# EAGLE board protoCtrl (EAGLE 6.3)
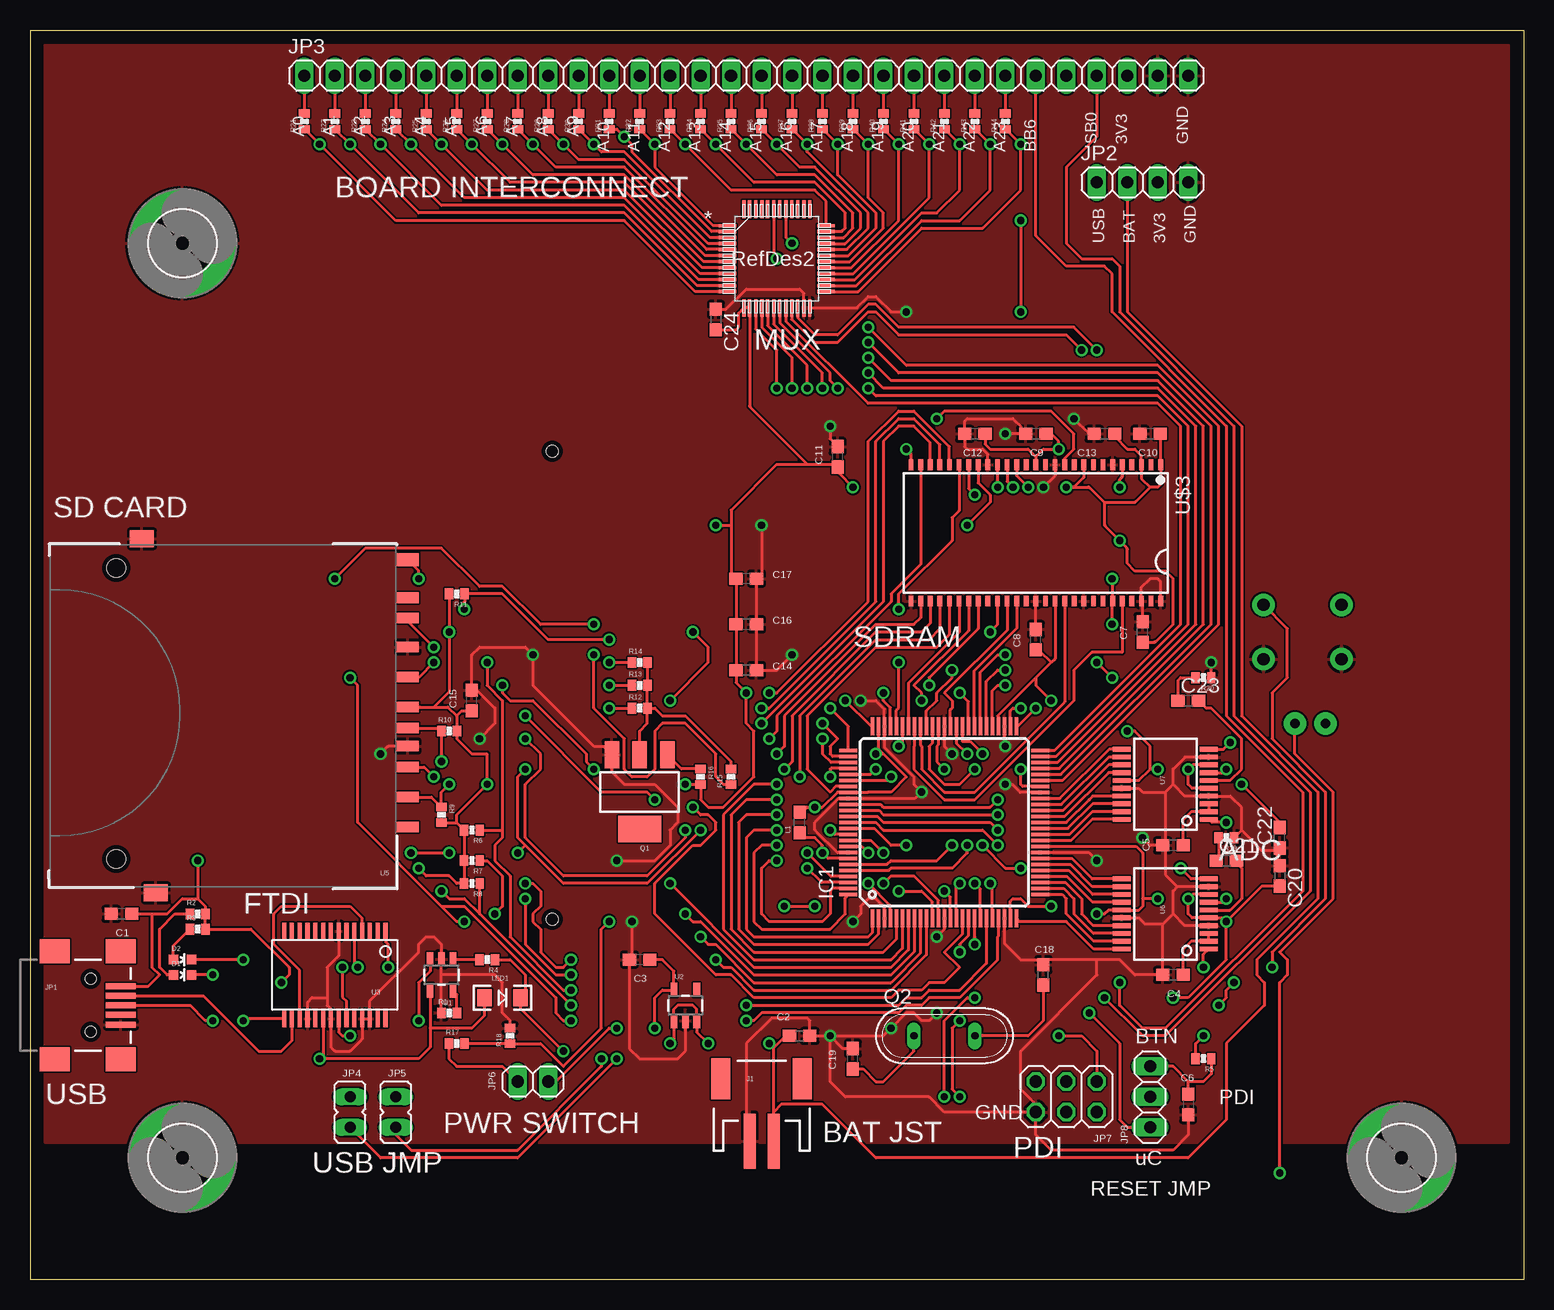
[diagram p2: board, top side]
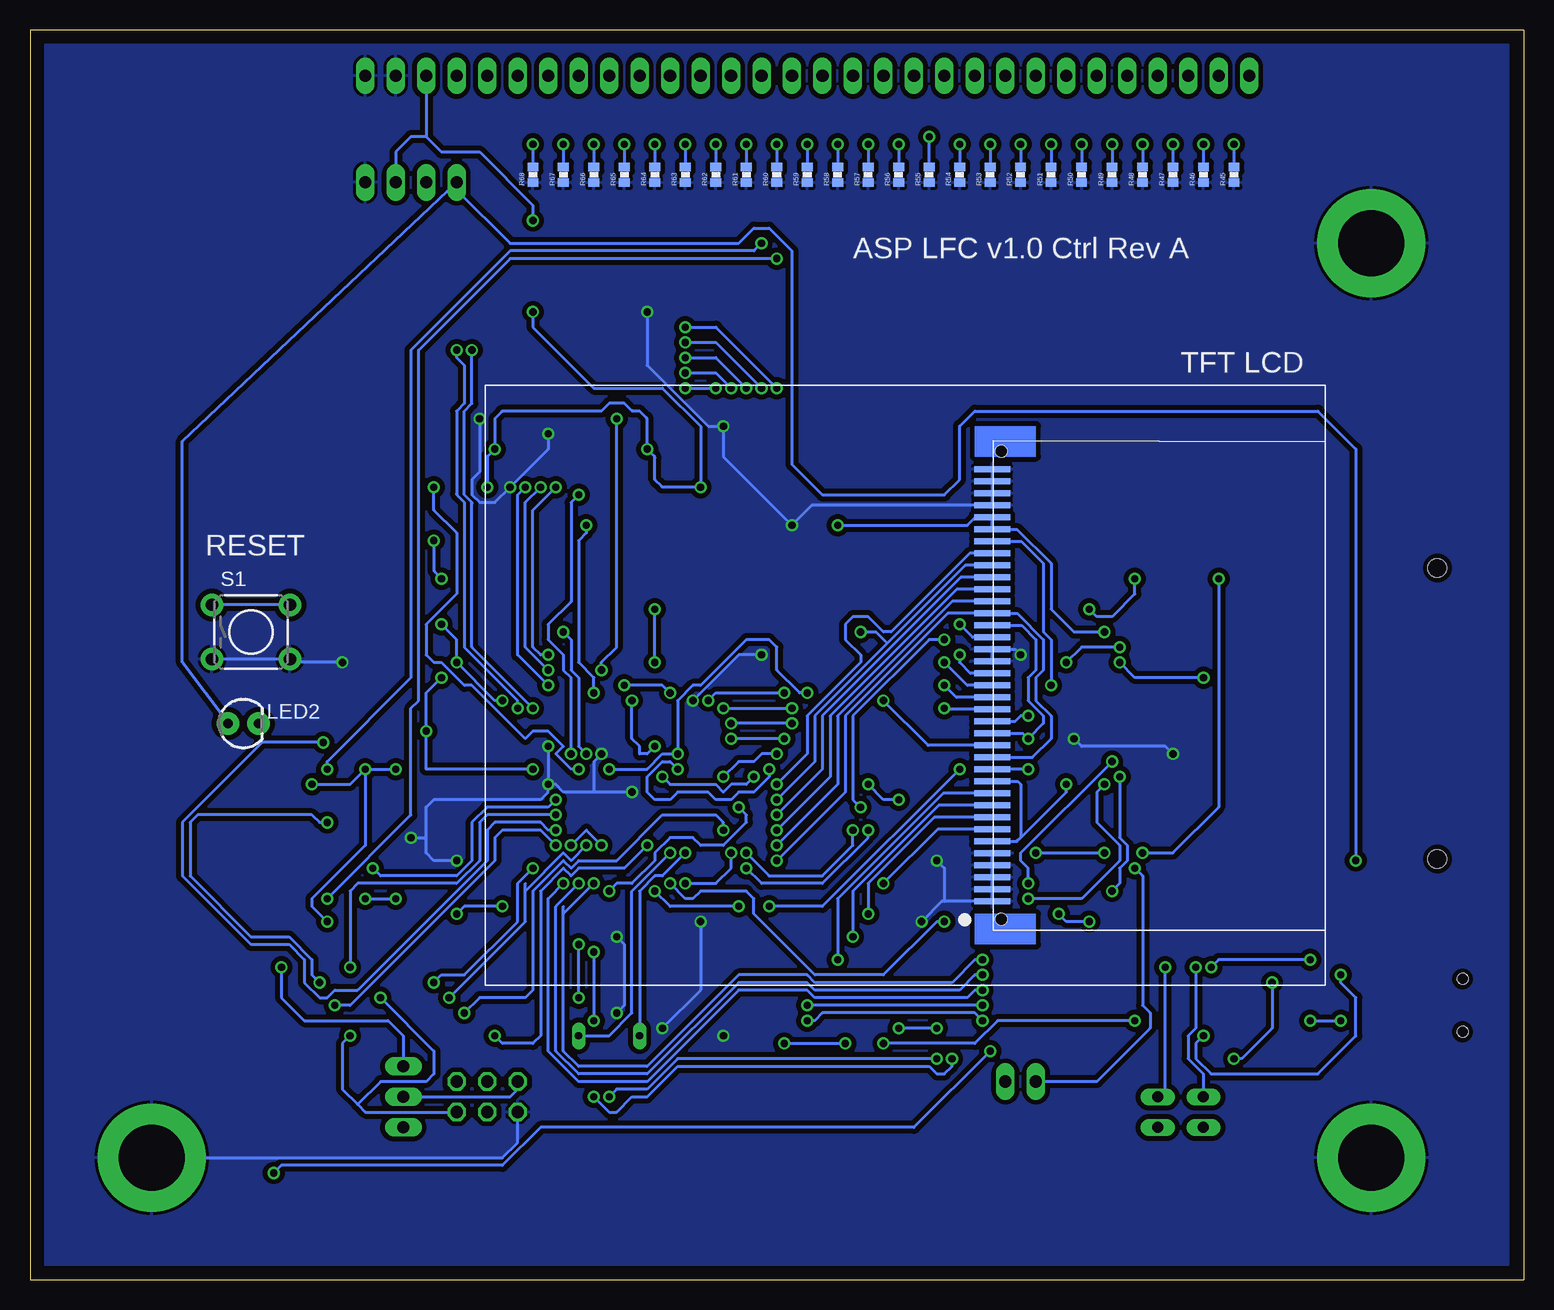
[diagram p3: board, bottom side, seen from below]

Size 124.46 x 104.14 mm. Coordinates in mm from the lower left corner, seen from the top.
Outline: 0,104.14 0,0 124.46,0 124.46,104.14 0,104.14
Copper layers (1*16): Top 0.035559375mm / dielectric 1.501140625mm / Bottom 0.035559375mm
Design rules "typical_4pcb": minimum track width 10mil, minimum drill 15mil, track to track 6mil, track to pad 6mil, pad to pad 6mil, via to via 6mil, smd to smd 6mil, copper to edge 15mil, drill to drill 8mil, minimum pad ring 10mil, minimum via ring 8mil, stop-mask expansion 4mil, vias tented up to drill 0mil, thermal gap 10mil

## Footprints (pad centres in the part's own frame; a part is rotated, then mirrored left to right if it is on the bottom)
C0603 = smd 1.1 x 1: 1 -0.85,0; 2 0.85,0
ILI9325_28INCH_TS = smd 0.5 x 3: 1 -18,27.77; 2 -17,27.77; 3 -16,27.77; 4 -15,27.77; 5 -14,27.77; 6 -13,27.77; 7 -12,27.77; 8 -11,27.77; 9 -10,27.77; 10 -9,27.77; 11 -8,27.77; 12 -7,27.77; 13 -6,27.77; 14 -5,27.77; 15 -4,27.77; 16 -3,27.77; 17 -2,27.77; 18 -1,27.77; 19 0,27.77; 20 1,27.77; 21 2,27.77; 22 3,27.77; 23 4,27.77; 24 5,27.77; 25 6,27.77; 26 7,27.77; 27 8,27.77; 28 9,27.77; 29 10,27.77; 30 11,27.77; 31 12,27.77; 32 13,27.77; 33 14,27.77; 34 15,27.77; 35 16,27.77; 36 17,27.77; 37 18,27.77 | hole 1: -19.5,27; 19.5,27
LED-0603 = smd 0.8 x 0.8: A 0,-0.75; C 0,0.75
5,5-PAD = drill 5.5 pad 9: B5,5 0,0
TQFP100 = smd 1.5 x 0.27: 1 -8,6; 2 -8,5.5; 3 -8,5; 4 -8,4.5; 5 -8,4; 6 -8,3.5; 7 -8,3; 8 -8,2.5; 9 -8,2; 10 -8,1.5; 11 -8,1; 12 -8,0.5; 13 -8,0; 14 -8,-0.5; 15 -8,-1; 16 -8,-1.5; 17 -8,-2; 18 -8,-2.5; 19 -8,-3; 20 -8,-3.5; 21 -8,-4; 22 -8,-4.5; 23 -8,-5; 24 -8,-5.5; 25 -8,-6; 51 8,-6; 52 8,-5.5; 53 8,-5; 54 8,-4.5; 55 8,-4; 56 8,-3.5; 57 8,-3; 58 8,-2.5; 59 8,-2; 60 8,-1.5; 61 8,-1; 62 8,-0.5; 63 8,0; 64 8,0.5; 65 8,1; 66 8,1.5; 67 8,2; 68 8,2.5; 69 8,3; 70 8,3.5; 71 8,4; 72 8,4.5; 73 8,5; 74 8,5.5; 75 8,6 | smd 0.27 x 1.5: 26 -6,-8; 27 -5.5,-8; 28 -5,-8; 29 -4.5,-8; 30 -4,-8; 31 -3.5,-8; 32 -3,-8; 33 -2.5,-8; 34 -2,-8; 35 -1.5,-8; 36 -1,-8; 37 -0.5,-8; 38 0,-8; 39 0.5,-8; 40 1,-8; 41 1.5,-8; 42 2,-8; 43 2.5,-8; 44 3,-8; 45 3.5,-8; 46 4,-8; 47 4.5,-8; 48 5,-8; 49 5.5,-8; 50 6,-8; 76 6,8; 77 5.5,8; 78 5,8; 79 4.5,8; 80 4,8; 81 3.5,8; 82 3,8; 83 2.5,8; 84 2,8; 85 1.5,8; 86 1,8; 87 0.5,8; 88 0,8; 89 -0.5,8; 90 -1,8; 91 -1.5,8; 92 -2,8; 93 -2.5,8; 94 -3,8; 95 -3.5,8; 96 -4,8; 97 -4.5,8; 98 -5,8; 99 -5.5,8; 100 -6,8
JST-2-SMD = smd 1 x 4.6: 1 -1,-3.7; 2 1,-3.7 | smd 1.6 x 3.4: NC1 -3.4,1.5; NC2 3.4,1.5
USB-MINIB = smd 2.5 x 0.5: D+ 2.5,0; D- 2.5,0.8; GND 2.5,-1.6; ID 2.5,-0.8; VBUS 2.5,1.6 | smd 2.5 x 2: MTN1 -3,4.5; MTN2 2.5,4.5; MTN3 -3,-4.5; MTN4 2.5,-4.5 | hole 0.9: 0,2.2; 0,-2.2
1X04 = drill 1.016 long: 1 -3.81,0; 2 -1.27,0; 3 1.27,0; 4 3.81,0
1X30 = drill 1.016 long: 1 -36.83,0; 2 -34.29,0; 3 -31.75,0; 4 -29.21,0; 5 -26.67,0; 6 -24.13,0; 7 -21.59,0; 8 -19.05,0; 9 -16.51,0; 10 -13.97,0; 11 -11.43,0; 12 -8.89,0; 13 -6.35,0; 14 -3.81,0; 15 -1.27,0; 16 1.27,0; 17 3.81,0; 18 6.35,0; 19 8.89,0; 20 11.43,0; 21 13.97,0; 22 16.51,0; 23 19.05,0; 24 21.59,0; 25 24.13,0; 26 26.67,0; 27 29.21,0; 28 31.75,0; 29 34.29,0; 30 36.83,0
JP1 = drill 0.914 long: 1 0,-1.27; 2 0,1.27
1X02 = drill 1.016 long: 1 -1.27,0; 2 1.27,0
2X03 = drill 1.016 octagon: 1 -2.54,-1.27; 2 -2.54,1.27; 3 0,-1.27; 4 0,1.27; 5 2.54,-1.27; 6 2.54,1.27
1X03 = drill 1.016 long: 1 -2.54,0; 2 0,0; 3 2.54,0
0603 = smd 1.1 x 1: 1 -0.85,0; 2 0.85,0
LED-1206 = smd 1.2 x 1.4: A -1.5,0; C 1.5,0
LED3MM = drill 0.813 pad 1.88: A -1.27,0; K 1.27,0
SOT223 = smd 1.219 x 2.235: 1 -2.311,-3.099; 2 0,-3.099; 3 2.311,-3.099 | smd 3.6 x 2.2: 4 0,3.099
QS = drill 0.61 long: 1 -2.54,0; 2 2.54,0
0402-RES = smd 0.7 x 0.9: 1 -0.65,0; 2 0.65,0
TACTILE-PTH = drill 1.016 pad 1.88: 1 -3.251,2.261; 2 3.251,2.261; 3 -3.251,-2.261; 4 3.251,-2.261
SOT23-5 = smd 0.55 x 1.2: 1 -0.95,-1.3; 2 0,-1.3; 3 0.95,-1.3; 4 0.95,1.3; 5 -0.95,1.3
SSOP28DB = smd 0.348 x 1.397: 1 -4.225,-3.656; 2 -3.575,-3.656; 3 -2.925,-3.656; 4 -2.275,-3.656; 5 -1.625,-3.656; 6 -0.975,-3.656; 7 -0.325,-3.656; 8 0.325,-3.656; 9 0.975,-3.656; 10 1.625,-3.656; 11 2.275,-3.656; 12 2.925,-3.656; 13 3.575,-3.656; 14 4.225,-3.656; 15 4.225,3.656; 16 3.575,3.656; 17 2.925,3.656; 18 2.275,3.656; 19 1.625,3.656; 20 0.975,3.656; 21 0.325,3.656; 22 -0.325,3.656; 23 -0.975,3.656; 24 -1.625,3.656; 25 -2.275,3.656; 26 -2.925,3.656; 27 -3.575,3.656; 28 -4.225,3.656
SU_48 = smd 1.473 x 0.279: 1 -4.115,2.743; 2 -4.115,2.261; 3 -4.115,1.753; 4 -4.115,1.245; 5 -4.115,0.762; 6 -4.115,0.254; 7 -4.115,-0.254; 8 -4.115,-0.762; 9 -4.115,-1.245; 10 -4.115,-1.753; 11 -4.115,-2.261; 12 -4.115,-2.743; 25 4.115,-2.743; 26 4.115,-2.261; 27 4.115,-1.753; 28 4.115,-1.245; 29 4.115,-0.762; 30 4.115,-0.254; 31 4.115,0.254; 32 4.115,0.762; 33 4.115,1.245; 34 4.115,1.753; 35 4.115,2.261; 36 4.115,2.743 | smd 0.279 x 1.473: 13 -2.743,-4.115; 14 -2.261,-4.115; 15 -1.753,-4.115; 16 -1.245,-4.115; 17 -0.762,-4.115; 18 -0.254,-4.115; 19 0.254,-4.115; 20 0.762,-4.115; 21 1.245,-4.115; 22 1.753,-4.115; 23 2.261,-4.115; 24 2.743,-4.115; 37 2.743,4.115; 38 2.261,4.115; 39 1.753,4.115; 40 1.245,4.115; 41 0.762,4.115; 42 0.254,4.115; 43 -0.254,4.115; 44 -0.762,4.115; 45 -1.245,4.115; 46 -1.753,4.115; 47 -2.261,4.115; 48 -2.743,4.115
SDCARD_4UCONN = smd 1.8 x 0.9: 1 -1,6.77; 2 -1,4.27; 3 -1,2.52; 4 -1,-0.73; 5 -1,-3.23; 6 -1,-5.73; 7 -1,-8.15; 8 -1,-9.85; 9 -1,9.27; CD -1,1.02 | smd 2 x 1.4: SH@1 20,14.75; SH@2 21.15,-14.75 | smd 1.8 x 1.1: WP -1,-13 | hole 1.55: 23.3,11.94; 23.3,-12.32
SSOP20 = smd 0.4 x 1.5: 1 -2.925,-3.625; 2 -2.275,-3.625; 3 -1.625,-3.625; 4 -0.975,-3.625; 5 -0.325,-3.625; 6 0.325,-3.625; 7 0.975,-3.625; 8 1.625,-3.625; 9 2.275,-3.625; 10 2.925,-3.625; 11 2.925,3.625; 12 2.275,3.625; 13 1.625,3.625; 14 0.975,3.625; 15 0.325,3.625; 16 -0.325,3.625; 17 -0.975,3.625; 18 -1.625,3.625; 19 -2.275,3.625; 20 -2.925,3.625
TSOP54-400 = smd 0.4 x 0.9: 1 -10.4,-5.68; 2 -9.6,-5.68; 3 -8.8,-5.68; 4 -8,-5.68; 5 -7.2,-5.68; 6 -6.4,-5.68; 7 -5.6,-5.68; 8 -4.8,-5.68; 9 -4,-5.68; 10 -3.2,-5.68; 11 -2.4,-5.68; 12 -1.6,-5.68; 13 -0.8,-5.68; 14 0,-5.68; 15 0.8,-5.68; 16 1.6,-5.68; 17 2.4,-5.68; 18 3.2,-5.68; 19 4,-5.68; 20 4.8,-5.68; 21 5.6,-5.68; 22 6.4,-5.68; 23 7.2,-5.68; 24 8,-5.68; 25 8.8,-5.68; 26 9.6,-5.68; 27 10.4,-5.68; 28 10.4,5.68; 29 9.6,5.68; 30 8.8,5.68; 31 8,5.68; 32 7.2,5.68; 33 6.4,5.68; 34 5.6,5.68; 35 4.8,5.68; 36 4,5.68; 37 3.2,5.68; 38 2.4,5.68; 39 1.6,5.68; 40 0.8,5.68; 41 0,5.68; 42 -0.8,5.68; 43 -1.6,5.68; 44 -2.4,5.68; 45 -3.2,5.68; 46 -4,5.68; 47 -4.8,5.68; 48 -5.6,5.68; 49 -6.4,5.68; 50 -7.2,5.68; 51 -8,5.68; 52 -8.8,5.68; 53 -9.6,5.68; 54 -10.4,5.68

## Placement (x,y rotation side)
C1  4.7uF  [C0603]  7.62,30.48 180 top
C2  4.7uF  [C0603]  64.13,20.32 0 top
C3  1uF  [C0603]  50.8,26.67 180 top
C4  0.1uF  [C0603]  95.25,25.4 180 top
C5  0.1uF  [C0603]  95.25,36.2 180 top
C6  100nF  [C0603]  96.52,14.61 270 top
C7  100nF  [C0603]  92.71,53.97 90 top
C8  100nF  [C0603]  83.82,53.34 90 top
C9  100nF  [C0603]  83.82,70.48 180 top
C10  100nF  [C0603]  93.34,70.48 180 top
C11  100nF  [C0603]  67.31,68.58 90 top
C12  100nF  [C0603]  78.74,70.48 180 top
C13  100nF  [C0603]  89.53,70.48 180 top
C14  100nF  [C0603]  59.69,50.8 180 top
C15  100nF  [C0603]  36.83,48.26 90 top
C16  100nF  [C0603]  59.69,54.61 180 top
C17  100nF  [C0603]  59.69,58.42 180 top
C18  15pF  [C0603]  84.46,25.4 90 top
C19  15pF  [C0603]  68.58,18.41 90 top
C20  0.1uF  [C0603]  104.14,33.66 270 top
C21  0.1uF  [C0603]  99.69,34.92 0 top
C22  0.1uF  [C0603]  104.14,36.83 90 top
C23  0.1uF  [C0603]  96.52,48.26 0 top
C24  0.1uF  [C0603]  57.15,80.01 270 top
CN1  [ILI9325_28INCH_TS]  16.51,49.53 90 bottom
D1  GREEN  [LED-0603]  12.7,25.4 270 top
D2  RED  [LED-0603]  12.7,26.67 270 top
H1  MOUNT-PAD-ROUND5.5  [5,5-PAD]  114.3,10.16 0 top
H2  MOUNT-PAD-ROUND5.5  [5,5-PAD]  12.7,10.16 0 top
H3  MOUNT-PAD-ROUND5.5  [5,5-PAD]  12.7,86.36 0 top
IC1  AVR_XMEGA_A1_100A  [TQFP100]  76.2,38.1 90 top
J1  [JST-2-SMD]  60.96,15.24 0 top
JP1  USBSMD  [USB-MINIB]  5.08,22.86 0 top
JP2  [1X04]  92.71,91.44 0 top
JP3  [1X30]  59.69,100.33 0 top
JP4  [JP1]  26.67,13.97 180 top
JP5  [JP1]  30.48,13.97 180 top
JP6  [1X02]  41.91,16.51 0 top
JP7  [2X03]  86.36,15.24 180 top
JP8  [1X03]  93.34,15.24 90 top
L1  Ferrite Bead  [0603]  64.13,38.1 90 top
LED1  [LED-1206]  39.37,23.5 0 top
LED2  [LED3MM]  106.68,46.36 0 bottom
Q1  [SOT223]  50.8,40.64 180 top
Q2  [QS]  76.2,20.32 0 top
R1  2.0k  [0402-RES]  34.93,22.22 0 top
R2  1k  [0402-RES]  13.97,30.48 0 top
R3  1k  [0402-RES]  13.97,29.21 0 top
R4  330  [0402-RES]  38.1,26.67 180 top
R5  10k  [0402-RES]  97.79,18.41 180 top
R6  10k  [0402-RES]  36.83,37.47 180 top
R7  10k  [0402-RES]  36.83,34.92 180 top
R8  10k  [0402-RES]  36.83,33.02 180 top
R9  10k  [0402-RES]  34.29,38.73 270 top
R10  10k  [0402-RES]  34.93,45.72 0 top
R11  10k  [0402-RES]  35.56,57.15 180 top
R12  4.7k  [0402-RES]  50.8,47.62 0 top
R13  4.7k  [0402-RES]  50.8,49.53 0 top
R14  4.7k  [0402-RES]  50.8,51.44 0 top
R15  4.7k  [0402-RES]  58.42,41.91 90 top
R16  1k  [0402-RES]  55.88,41.91 270 top
R17  330  [0402-RES]  35.56,19.68 0 top
R18  100  [0402-RES]  40.01,20.32 90 top
R19  25  [0402-RES]  99.69,36.83 180 top
R20  25  [0402-RES]  97.79,50.17 180 top
R21  560  [0402-RES]  22.86,96.52 90 top
R22  560  [0402-RES]  25.4,96.52 90 top
R23  560  [0402-RES]  27.94,96.52 90 top
R24  560  [0402-RES]  30.48,96.52 90 top
R25  560  [0402-RES]  33.02,96.52 90 top
R26  560  [0402-RES]  35.56,96.52 90 top
R27  560  [0402-RES]  38.1,96.52 90 top
R28  560  [0402-RES]  40.64,96.52 90 top
R29  560  [0402-RES]  43.18,96.52 90 top
R30  560  [0402-RES]  45.72,96.52 90 top
R31  560  [0402-RES]  48.26,96.52 90 top
R32  560  [0402-RES]  50.8,96.52 90 top
R33  560  [0402-RES]  53.34,96.52 90 top
R34  560  [0402-RES]  55.88,96.52 90 top
R35  560  [0402-RES]  58.42,96.52 90 top
R36  560  [0402-RES]  60.96,96.52 90 top
R37  560  [0402-RES]  63.5,96.52 90 top
R38  560  [0402-RES]  66.04,96.52 90 top
R39  560  [0402-RES]  68.58,96.52 90 top
R40  560  [0402-RES]  71.12,96.52 90 top
R41  560  [0402-RES]  73.66,96.52 90 top
R42  560  [0402-RES]  76.2,96.52 90 top
R43  560  [0402-RES]  78.74,96.52 90 top
R44  560  [0402-RES]  81.28,96.52 90 top
R45  100  [0402-RES]  24.13,92.08 90 bottom
R46  100  [0402-RES]  26.67,92.08 90 bottom
R47  100  [0402-RES]  29.21,92.08 90 bottom
R48  100  [0402-RES]  31.75,92.08 90 bottom
R49  100  [0402-RES]  34.29,92.08 90 bottom
R50  100  [0402-RES]  36.83,92.08 90 bottom
R51  100  [0402-RES]  39.37,92.08 90 bottom
R52  100  [0402-RES]  41.91,92.08 90 bottom
R53  100  [0402-RES]  44.45,92.08 90 bottom
R54  100  [0402-RES]  46.99,92.08 90 bottom
R55  100  [0402-RES]  49.53,92.08 90 bottom
R56  100  [0402-RES]  52.07,92.08 90 bottom
R57  100  [0402-RES]  54.61,92.08 90 bottom
R58  100  [0402-RES]  57.15,92.08 90 bottom
R59  100  [0402-RES]  59.69,92.08 90 bottom
R60  100  [0402-RES]  62.23,92.08 90 bottom
R61  100  [0402-RES]  64.77,92.08 90 bottom
R62  100  [0402-RES]  67.31,92.08 90 bottom
R63  100  [0402-RES]  69.85,92.08 90 bottom
R64  100  [0402-RES]  72.39,92.08 90 bottom
R65  100  [0402-RES]  74.93,92.08 90 bottom
R66  100  [0402-RES]  77.47,92.08 90 bottom
R67  100  [0402-RES]  80.01,92.08 90 bottom
R68  100  [0402-RES]  82.55,92.08 90 bottom
S1  [TACTILE-PTH]  106.04,53.97 0 bottom
U1  MCP73831  [SOT23-5]  34.29,25.4 180 top
U2  V_REG_LDOSMD  [SOT23-5]  54.61,22.86 0 top
U3  FT232RLSSOP  [SSOP28DB]  25.4,25.4 180 top
U4  ADG726BSUZ  [SU_48]  62.23,85.09 0 top
U5  SD_CARD_SOCKET4UCON  [SDCARD_4UCONN]  30.48,46.99 180 top
U6  AD9283BRSZ-80REAL  [SSOP20]  94.62,30.48 90 top
U7  AD9283BRSZ-80REAL  [SSOP20]  94.62,41.28 90 top
U$3  MT48LC16M4A2TG-75:G  [TSOP54-400]  83.82,62.23 180 top

## Tracks (layer width: path | path; a pad name or v marks a point on that pad's centre or on a via)
+3V3  (via drill 0.6)
  Top 0.254: U$3.43 85.42,51.77 85.09,51.44 | 85.09,51.44 83.82,50.17 | 83.82,50.17 80.65,46.99 80.7,46.94 IC1.54 | 71.12,43.81 73.03,41.91 71.75,40.64 69.85,40.64 69.81,40.6 IC1.83 67.35,40.6 67.31,40.64 66.04,39.37 v65.41,39.37 64.77,39.37 64.35,38.95 L1.2 | 71.12,43.81 70.7,44.23 IC1.74 | v90.17,54.61 90.17,56.5 U$3.49 arc-45 90.17,56.67 v90.17,58.42 | R11.2 34.93,57.13 v34.93,53.97 34.93,48.99 33.66,47.72 | 33.66,47.72 U5.4 32.48,47.72 | 33.66,47.72 34.83,47.72 35.56,46.99 | 35.56,46.99 35.56,45.73 R10.2 35.57,45.07 36.83,43.81 38.1,43.81 v38.1,41.28 35.56,38.73 35.56,38.08 | 93.34,66.04 93.98,66.04 94.22,66.28 U$3.1 94.22,70.46 C10.1 | 93.34,66.04 92.62,66.77 U$3.3 92.62,68.67 92.07,69.22 91.44,69.22 90.38,70.27 C13.1 | v70.48,43.81 71.12,43.81 | v41.27,46.99 47.62,40.64 51.43,40.64 v52.07,40 | 83.82,68.58 U$3.14 | 83.82,68.58 83.19,69.22 80.01,69.22 79.59,69.63 C12.1 | 87.75,66.79 87.82,66.86 U$3.9 87.82,66.97 arc-45 87.75,66.79 | 87,66.04 v86.36,66.04 88.26,66.04 88.34,65.97 | C9.1 85.09,70.48 85.72,69.85 v85.72,69.22 84.46,69.22 83.82,68.58 | U$3.27 73.42,68.72 arc45 73.35,68.89 v73.03,69.22 | v68.58,66.04 67.38,67.24 arc-45 67.31,67.41 C11.1 67.17,67.87 arc45 66.99,67.94 64.77,67.94 | 87.75,66.79 87,66.04 | 87,66.04 88.16,66.04 arc-45 88.34,65.97 | 88.34,65.97 89.53,64.77 | 89.53,64.77 91.97,64.77 arc45 92.15,64.84 93.34,66.04 | 89.53,64.77 89.53,62.97 arc45 89.61,62.79 v90.81,61.59 91.37,61.03 arc-45 91.44,60.86 91.44,59.69 92.07,59.05 94.62,59.05 95.25,58.42 95.25,54.61 93.84,53.2 arc-45 93.66,53.12 C7.1 | 64.77,67.94 60.04,72.67 arc-45 59.97,72.85 U4.14 U4.13 59.05,80.54 59.05,79.38 58.84,79.16 C24.2
  Top 0.254: C8.1 83.93,52.49 arc-45 84.11,52.42 85.09,51.44 | R9.2 35.56,38.08 | 35.56,38.08 R6.2 R7.2 R8.2 35.56,33.02 34.93,33.66 33.02,33.66 v32.38,34.29 | IC1.44 82.72,41.1 82.55,41.28 v82.55,42.55 | IC1.34 92.17,36.1 92.71,35.56 92.71,31.75 | R5.2 97.14,19.67 v97.79,20.32 | IC1.24 81.7,31.54 81.91,31.75 82.55,31.75 83.19,31.11 v85.09,31.11 | v82.55,88.27 v82.55,80.64 | v95.25,23.5 96.52,23.5 99.69,26.67 v99.69,29.85 | v90.17,50.17 v88.9,51.44 | 83.82,50.17 83.82,49.53 v85.09,48.26 | v54.61,41.28 55.87,41.28 R16.2 55.88,40 56.51,39.37 57.79,39.37 60.32,41.91 60.32,45.72 59.69,46.36 v59.69,48.89 58.84,49.75 C14.2 C16.2 C17.2 58.42,58.84 58.42,62.86 | IC1.64 75.7,44.58 75.56,44.45 75.56,43.18 v76.2,42.55 | 58.42,62.86 58.42,64.13 62.23,67.94 64.77,67.94 | v57.15,62.86 58.42,62.86 | 35.56,46.99 35.98,47.41 C15.1 | R17.1 34.91,18.43 35.56,17.78 39.37,17.78 JP6.1 | v99.69,29.85 99.38,30.15 U6.5 96.84,30.15 96.52,30.48 v96.52,31.75 96.88,32.11 U6.8 | 92.71,31.75 92.71,31.11 92.4,30.81 U6.15 89.86,30.81 89.53,30.48 v88.9,30.48 | v93.98,31.75 92.71,31.75 | U7.8 96.88,42.9 v96.52,42.55 96.52,41.28 96.84,40.95 U7.5 | v93.98,42.55 93.34,42.55 | U7.15 92.4,41.6 93.34,42.55 | 93.34,42.55 93.34,44.45 92.07,45.72 v91.44,45.72 | IC1.14 76.7,31.89 v76.2,32.39 | C20.2 102.66,32.81 v99.69,29.85 | C22.2 104.14,38.1 v100.97,41.28
  Bottom 0.254: CN1.11 42.16,41.53 41.91,41.28 41.91,36.83 | CN1.6 42.21,36.53 41.91,36.83 | v59.69,48.89 60.32,48.89 62.23,50.8 62.23,52.7 62.87,53.34 64.77,53.34 68.58,49.53 69.22,49.53 70.48,48.26 v70.48,43.81 71.75,43.81 73.03,42.55 v76.2,42.55 | v41.27,46.99 41.91,46.99 42.37,46.53 CN1.16 | v90.81,61.59 90.81,59.16 arc-45 90.73,58.98 v90.17,58.42 | v32.38,34.29 31.75,33.66 31.75,22.86 31.12,22.22 31.12,20.96 35.56,16.51 JP6.1 | v97.79,20.32 98.43,19.68 98.43,15.88 97.16,14.61 | 97.16,14.61 96.52,13.97 JP7.2 | JP3.28 91.44,95.25 | 91.44,95.25 90.17,93.98 87,93.98 82.55,89.53 v82.55,88.27 | v82.55,80.64 82.55,79.38 77.47,74.3 71.75,74.3 68.58,71.12 v68.58,66.04 71.65,66.04 arc45 71.83,66.11 72.39,66.67 72.39,68.47 arc-45 72.46,68.65 v73.03,69.22 73.03,71.65 arc-45 73.1,71.83 73.66,72.39 74.19,72.39 arc45 74.37,72.46 74.93,73.02 76.2,73.02 76.84,72.39 84.98,72.39 arc-45 85.16,72.32 85.72,71.75 v85.72,69.22 86.36,68.58 v86.36,66.04 | v95.25,23.5 90.81,19.05 90.81,17.14 91.44,16.51 95.25,16.51 97.16,14.61 | v82.55,42.55 91.44,42.55 v91.44,45.72 91.44,48.89 v90.17,50.17 | v90.17,54.61 88.9,53.34 v88.9,51.44 85.72,48.26 v85.09,48.26 | v52.07,40 53.34,40 v54.61,41.28 | 41.91,36.83 38.1,40.64 v38.1,41.28 | v65.41,39.37 64.77,38.73 64.77,38.1 66.68,36.2 68.58,36.2 69.22,36.83 71.12,36.83 72.39,35.56 72.39,34.92 74.29,33.02 75.56,33.02 v76.2,32.39 | v57.15,62.86 46.35,62.86 45.72,63.5 44.31,63.5 CN1.33 CN1.32 42.21,62.53 39.37,59.69 39.37,55.88 37.46,53.97 v34.93,53.97 | 91.44,95.25 92.71,95.25 93.98,93.98 JP2.3 | v96.52,31.75 v93.98,31.75 | v96.52,42.55 v93.98,42.55
  Bottom 0.254: v85.09,31.11 88.26,31.11 v88.9,30.48 | v96.52,42.55 96.52,36.2 100.97,31.75 100.97,31.11 v99.69,29.85 | v100.97,41.28 97.79,41.28 v96.52,42.55
+3V7  (via drill 0.6)
  Top 0.254: U1.3 33.34,25.72 32.38,24.77 v32.38,21.59 | J1.2 61.96,13.97 | 61.96,13.97 61.96,19.32 | 61.96,19.32 v61.6,19.68 | v56.51,19.68 55.56,20.64 U2.3 55.56,22.54 55.24,22.86 53.98,22.86 53.66,22.54 U2.1 53.66,20 v53.34,19.68 | C2.1 62.96,20.32 61.96,19.32 | JP2.2 91.44,80.64 100.97,71.12 100.97,46.99 107.31,40.64 107.31,31.75 102.23,26.67 102.23,25.4 102.87,24.77 102.87,22.86 99.69,19.68 99.69,13.34 96.52,10.16 70.48,10.16 66.04,14.61 62.6,14.61 61.96,13.97
  Bottom 0.254: v32.38,21.59 43.82,21.59 45.72,19.68 v53.34,19.68 | v61.6,19.68 v56.51,19.68
+5V  (via drill 0.6)
  Top 0.254: 10.16,30.48 11.43,30.48 12.7,31.75 13.97,31.75 | 13.97,31.75 14.6,31.11 14.6,30.5 R2.2 R3.2 18.41,29.21 21.59,26.04 21.59,25.4 v20.95,24.77 | v13.97,34.92 13.97,31.75 | U3.20 24.42,18.71 v24.13,18.41 32.38,18.41 33.34,19.37 33.34,20.96 | U1.4 33.34,20.96 | LED1.A 37.87,22 36.83,20.96 33.34,20.96 | C1.1 10.16,30.48 | 10.16,30.48 10.16,26.04 10.8,25.4 9.85,24.46 JP1.VBUS
  Bottom 0.254: v13.97,34.92 13.97,69.22 17.14,72.39 45.72,72.39 46.99,71.12 46.99,66.67 48.26,65.41 58.42,65.41 60.96,67.94 60.96,85.72 62.87,87.63 64.13,87.63 65.41,86.36 84.46,86.36 88.9,90.8 JP2.1 111.76,69.85 111.76,51.44 LED2.A | v20.95,24.77 20.95,20.96 23.49,18.41 v24.13,18.41
ANALOG0  (via drill 0.6)
  Top 0.254: U4.12 55.45,82.35 49.53,88.27 30.48,88.27 v24.13,94.61 22.88,95.87 R21.1
  Bottom 0.254: v24.13,94.61 R45.2
ANALOG1  (via drill 0.6)
  Top 0.254: U4.11 55.6,82.83 49.53,88.9 32.38,88.9 v26.67,94.61 | 25.4,95.88 v26.67,94.61 | R22.1 25.41,95.87 v26.67,94.61
  Bottom 0.254: v26.67,94.61 R46.2
ANALOG2  (via drill 0.6)
  Top 0.254: U4.10 55.73,83.34 49.53,89.53 34.29,89.53 v29.21,94.61 27.95,95.87 R23.1
  Bottom 0.254: v29.21,94.61 R47.2
ANALOG3  (via drill 0.6)
  Top 0.254: U4.9 55.85,83.84 49.53,90.17 36.2,90.17 v31.75,94.61 30.49,95.87 R24.1
  Bottom 0.254: v31.75,94.61 R48.2
ANALOG4  (via drill 0.6)
  Top 0.254: U4.8 56.01,84.33 49.53,90.8 38.1,90.8 v34.29,94.61 33.03,95.87 R25.1
  Bottom 0.254: v34.29,94.61 R49.2
ANALOG5  (via drill 0.6)
  Top 0.254: U4.7 56.13,84.84 49.53,91.44 40.01,91.44 v36.83,94.61 35.57,95.87 R26.1
  Bottom 0.254: v36.83,94.61 R50.2
ANALOG6  (via drill 0.6)
  Top 0.254: U4.6 56.26,85.34 49.53,92.08 41.91,92.08 v39.37,94.61 38.12,95.87 R27.1
  Bottom 0.254: v39.37,94.61 R51.2
ANALOG7  (via drill 0.6)
  Top 0.254: U4.5 56.39,85.85 49.53,92.71 43.82,92.71 v41.91,94.61 40.65,95.87 R28.1
  Bottom 0.254: v41.91,94.61 R52.2
ANALOG8  (via drill 0.6)
  Top 0.254: U4.4 56.54,86.33 49.53,93.34 45.72,93.34 v44.45,94.61 43.2,95.87 R29.1
  Bottom 0.254: v44.45,94.61 R53.2
ANALOG9  (via drill 0.6)
  Top 0.254: U4.3 56.67,86.84 49.53,93.98 47.62,93.98 v46.99,94.61 45.73,95.87 R30.1
  Bottom 0.254: v46.99,94.61 R54.2
ANALOG10  (via drill 0.6)
  Top 0.254: U4.2 56.79,87.35 50.16,93.98 50.16,94.61 v49.53,95.25 48.91,95.87 R31.1
  Bottom 0.254: R55.2 v49.53,95.25
ANALOG11  (via drill 0.6)
  Top 0.254: U4.1 56.95,87.83 52.07,92.71 v52.07,94.61 50.82,95.87 R32.1
  Bottom 0.254: v52.07,94.61 R56.2
ANALOG12  (via drill 0.6)
  Top 0.254: U4.36 66.34,89.86 65.41,90.8 58.42,90.8 v54.61,94.61 53.35,95.87 R33.1
  Bottom 0.254: v54.61,94.61 R57.2
ANALOG13  (via drill 0.6)
  Top 0.254: U4.35 67.67,87.35 67.94,87.63 67.94,88.9 65.41,91.44 60.32,91.44 v57.15,94.61 55.9,95.87 R34.1
  Bottom 0.254: v57.15,94.61 R58.2
ANALOG14  (via drill 0.6)
  Top 0.254: U4.34 67.79,86.84 68.58,87.63 68.58,88.9 65.41,92.08 62.23,92.08 v59.69,94.61 58.43,95.87 R35.1
  Bottom 0.254: v59.69,94.61 R59.2
ANALOG15  (via drill 0.6)
  Top 0.254: U4.33 67.92,86.33 69.22,87.63 69.22,88.9 65.41,92.71 64.13,92.71 v62.23,94.61 60.98,95.87 R36.1
  Bottom 0.254: v62.23,94.61 R60.2
ANALOG16  (via drill 0.6)
  Top 0.254: U4.32 68.07,85.85 69.85,87.63 69.85,88.9 64.77,93.98 v64.77,94.61 63.51,95.87 R37.1
  Bottom 0.254: v64.77,94.61 R61.2
ANALOG17  (via drill 0.6)
  Top 0.254: U4.31 68.2,85.34 70.48,87.63 70.48,88.9 67.31,92.08 v67.31,94.61 66.06,95.87 R38.1
  Bottom 0.254: v67.31,94.61 R62.2
ANALOG18  (via drill 0.6)
  Top 0.254: U4.30 68.33,84.84 71.12,87.63 71.12,88.9 69.85,90.17 v69.85,94.61 68.59,95.87 R39.1
  Bottom 0.254: v69.85,94.61 R63.2
ANALOG19  (via drill 0.6)
  Top 0.254: U4.29 68.45,84.33 72.39,88.27 v72.39,94.61 71.13,95.87 R40.1
  Bottom 0.254: v72.39,94.61 R64.2
ANALOG20  (via drill 0.6)
  Top 0.254: U4.28 68.6,83.84 74.93,90.17 v74.93,94.61 73.68,95.87 R41.1
  Bottom 0.254: v74.93,94.61 R65.2
ANALOG21  (via drill 0.6)
  Top 0.254: U4.27 68.73,83.34 74.29,88.9 75.56,88.9 77.47,90.8 v77.47,94.61 76.22,95.87 R42.1
  Bottom 0.254: v77.47,94.61 R66.2
ANALOG22  (via drill 0.6)
  Top 0.254: U4.26 68.86,82.83 74.29,88.27 77.47,88.27 80.01,90.8 v80.01,94.61 78.75,95.87 R43.1
  Bottom 0.254: v80.01,94.61 R67.2
ANALOG23  (via drill 0.6)
  Top 0.254: U4.25 69.01,82.35 74.29,87.63 79.38,87.63 82.55,90.8 v82.55,94.61 81.29,95.87 R44.1
  Bottom 0.254: v82.55,94.61 R68.2
BREAKOUTBAR6  (via drill 0.6)
  Top 0.254: v90.81,24.77 90.81,22.86 92.71,20.96 94.62,20.96 106.04,32.39 106.04,40.64 99.69,46.99 99.69,71.12 90.17,80.64 90.17,83.82 89.53,84.45 86.36,84.45 83.82,86.99 JP3.25 | IC1.95 71.43,34.6 71.75,34.92 75.56,34.92 v76.84,36.2 | v79.38,36.2 81.28,34.29 v82.55,34.29
  Bottom 0.254: v90.81,24.77 90.17,25.4 88.26,25.4 83.82,29.85 83.82,33.02 v82.55,34.29 | v76.84,36.2 78.1,37.47 v79.38,36.2
D+  (via drill 0.6)
  Top 0.254: U3.15 17.93,21.74 v17.78,21.59 | v15.24,21.59 14.6,21.59 13.34,22.86 JP1.D+
  Bottom 0.254: v17.78,21.59 v15.24,21.59
D-
  Top 0.254: JP1.D- 14.44,23.66 19.05,19.05 20.95,19.05 21.82,19.92 U3.16
GND  (via drill 0.6)
  Top 0.254: U$3.54 94.22,58.18 93.98,58.42 93.34,58.42 92.62,57.69 U$3.52 92.64,56.53 arc-45 92.71,56.36 C7.2 | J1.1 59.69,11.81 59.69,19.68 61.81,21.81 64.77,21.81 64.98,21.59 C2.2 v66.68,20.32 | IC1.3 71.2,31.04 70.48,31.75 69.85,31.75 69.22,31.11 69.22,30.48 v68.58,29.85 | v63.5,52.07 62.23,50.8 C14.1 C16.1 C17.1 60.96,58.84 v60.96,62.86 | v69.22,48.26 70.48,48.26 71.2,47.55 IC1.73 71.2,44.37 73.66,41.91 73.66,41.28 v74.29,40.64 73.75,40.1 IC1.84 67.41,40.1 65.41,38.1 65.41,37.47 67.31,35.56 67.35,35.6 IC1.93 | C6.2 96.52,12.07 95.25,10.8 85.09,10.8 83.82,12.07 JP7.6 | JP7.6 76.2,13.97 74.93,15.24 67.94,15.24 66.68,16.51 v66.68,20.32 | U$3.19 79.82,68.77 79.38,69.22 78.1,69.22 77.89,69.43 C12.2 77.89,71.54 78.1,71.75 81.91,71.75 82.55,71.12 82.55,70.91 C9.2 v81.28,70.48 | 90.17,68.03 arc45 U$3.6 | C8.2 U$3.41 | 31.44,52.7 arc45 U5.6 | U5.3 29.97,44.47 arc45 29.79,44.4 v29.21,43.81 | IC1.43 82.51,40.6 81.84,41.28 v81.28,41.28 | U4.24 68.91,80.97 69.85,81.91 70.48,81.91 71.75,80.64 v73.03,80.64 | v66.68,71.12 66.68,70.06 C11.2 | R1.1 34.27,25.4 | 34.27,25.4 34.27,26.68 U1.2 34.29,27.94 33.66,28.57 33.02,28.57 32.38,27.94 32.38,27.31 28.32,23.25 U3.26 U3.25 27.67,20.06 26.67,19.05 25.4,19.05 25.07,19.38 U3.21 25.07,22.55 24.77,22.86 24.77,23.5 | v50.16,29.85 50.16,26.89 C3.2 49.95,19.27 50.8,18.41 53.98,18.41 54.61,19.05 U2.2 | IC1.33 88.22,35.6 v88.9,34.92 | v66.68,20.32 67.73,19.27 C19.2 68.79,19.05 | IC1.13 76.2,29.21 v75.56,28.57 | v66.68,20.32 71.12,20.32 v71.75,20.96 73.03,22.22 73.66,22.22 74.29,21.59 74.93,21.59 v75.56,22.22 | 88.9,26.67 84.88,26.67 C18.2 84.03,26.67 82.55,26.67 81.2,28.02 IC1.23
  Top 0.254: v37.46,45.08 38.73,46.36 38.73,47.62 37.25,49.11 C15.2 36.83,52.07 37.46,52.7 41.27,52.7 v41.91,52.07 41.91,49.53 46.99,44.45 47.78,44.45 Q1.3 48.49,42.32 49.53,41.28 52.07,41.28 53.98,39.37 53.98,38.1 53.34,37.47 53.34,36.2 52.07,34.92 v48.9,34.92 | R18.2 40.01,21.59 39.37,22.22 39.37,24.77 38.73,25.4 34.27,25.4 | U3.7 25.73,27 24.77,26.04 24.77,23.5 | 96.86,29.5 U6.4 96.22,29.5 95.25,30.48 | 94.4,29.63 C4.2 92.07,25.4 90.81,26.67 88.9,26.67 | 94.4,29.63 95.25,30.48 | 95.25,30.48 95.25,32.39 95.62,32.75 | U6.9 95.62,32.75 | 94.4,29.63 92.93,29.63 92.4,30.15 U6.16 | 94.62,40.64 94.62,36.41 | 94.62,36.41 C5.2 | U7.9 96.25,43.55 95.25,42.55 95.25,41.28 | 94.62,40.64 95.25,41.28 | 95.25,41.28 96.22,40.3 U7.4 100.03,40.3 100.97,39.37 100.97,37.47 | U7.16 92.4,40.95 92.71,40.64 94.62,40.64 | 94.62,36.41 94.62,36.2 | 94.62,36.2 94.62,33.76 95.62,32.75 | JP7.6 83.82,14.61 82.55,15.88 82.55,19.05 88.9,25.4 88.9,26.67 | IC1.63 76.2,44.45 v76.84,43.81 | R19.1 100.34,36.84 100.97,37.47 | C20.1 103.92,34.5 103.92,35.77 | C24.1 58,80.86 59.69,82.55 64.13,82.55 64.49,82.19 U4.23 | 103.92,35.77 C22.1 | 103.92,35.77 102.66,35.77 100.97,37.47 | R20.1 98.44,51.42 v98.43,51.44 | 94.62,36.2 93.34,36.2 v92.71,36.83 | v84.46,66.04 85.42,67 U$3.12 | C13.2 88.26,70.48 v87,71.75 | IC1.53 81.2,44.53 v81.28,44.45 | U3.18 23.12,23.13 23.49,23.5 24.77,23.5
  Bottom 0.254: CN1.5 CN1.4 CN1.3 CN1.2 CN1.1 48.26,31.53 | CN1.21 CN1.22 42.37,52.53 v41.91,52.07 | CN1.37 CN1.36 CN1.35 CN1.34 59.29,64.53 v60.96,62.86 66.68,68.58 v66.68,71.12 67.94,71.12 73.03,76.2 v73.03,80.64 | v68.58,29.85 68.58,24.13 v71.75,20.96 | v63.5,52.07 65.41,52.07 v69.22,48.26 | v29.21,43.81 29.84,44.45 36.83,44.45 v37.46,45.08 | 48.26,31.53 48.48,31.53 v50.16,29.85 | v48.9,34.92 48.26,34.29 48.26,31.53 | v88.9,34.92 90.81,34.92 91.44,35.56 91.44,36.83 | 91.44,36.83 91.44,39.37 90.81,40 81.91,40 81.28,40.64 v81.28,41.28 | v75.56,28.57 74.93,27.94 74.93,22.86 v75.56,22.22 | S1.3 S1.4 102.51,51.44 v98.43,51.44 | H1.B5,5 85.09,10.16 83.82,11.43 JP7.6 | v74.29,40.64 77.47,40.64 | 77.47,40.64 80.01,40.64 80.65,41.28 v81.28,41.28 | v92.71,36.83 91.44,36.83 | v81.28,70.48 81.28,69.22 v84.46,66.04 85.72,64.77 87,64.77 87.63,65.41 87.63,66.67 87,67.31 v87,71.75 | v76.84,43.81 77.47,43.18 77.47,40.64 | v81.28,44.45 v81.28,41.28
  pour Top: 1.27,102.87 123.19,102.87 123.19,11.43 1.27,11.43
  pour Bottom (isolate 0.406, rank 2): 1.27,102.87 123.19,102.87 123.19,1.27 1.27,1.27
MISO  (via drill 0.6)
  Top 0.254: U5.7 31.48,54.88 v33.66,52.7 | v45.09,24.13 44.45,24.13 40.01,28.57 40.01,33.66 38.73,34.92 38.73,36.2 39.37,36.83 39.37,37.47 | R6.1 39.37,37.47 | v38.1,51.44 38.1,49.53 39.37,48.26 39.37,37.47 | IC1.21 80.2,32.83 v80.01,33.02
  Bottom 0.254: v33.66,52.7 36.83,52.7 v38.1,51.44 | v45.09,24.13 45.72,24.13 46.35,23.5 59.05,23.5 59.69,24.13 65.41,24.13 73.03,16.51 78.74,16.51 81.28,19.05 81.28,31.75 v80.01,33.02
MOSI  (via drill 0.6)
  Top 0.254: U5.2 32.84,42.72 v33.66,41.91 | IC1.20 79.7,26.36 77.47,24.13 74.93,24.13 74.29,23.5 73.03,23.5 72.39,22.86 v59.69,22.86 | v45.09,22.86 37.46,30.48 | 37.46,30.48 37.46,32.37 R8.1 | v34.29,32.39 34.93,31.75 36.2,31.75 37.46,30.48
  Bottom 0.254: v34.29,32.39 33.66,33.02 33.66,34.29 33.02,34.92 33.02,36.2 33.66,36.83 v33.66,41.91 | v45.09,22.86 v59.69,22.86
N$1  (via drill 0.6)
  Top 0.254: U3.22 25.73,20.63 26.03,20.32 v26.67,20.32 | v15.24,25.4 D1.C
  Bottom 0.254: v26.67,20.32 27.3,19.68 27.3,18.41 26.03,17.14 17.14,17.14 13.97,20.32 13.97,23.5 15.24,24.77 v15.24,25.4
N$2  (via drill 0.6)
  Top 0.254: R4.1 40.01,26.67 41.27,25.4 41.27,23.9 LED1.C 40.87,22.63 v44.45,19.05 | v104.14,8.89 104.14,24.77 104.78,25.4 104.78,26.67 104.14,27.31 108.58,31.75 108.58,40.64 105.41,43.81 LED2.K
  Bottom 0.254: v44.45,19.05 50.8,12.7 81.91,12.7 85.09,9.53 103.5,9.53 v104.14,8.89
N$3  (via drill 0.6)
  Top 0.254: U3.23 26.38,23.2 26.03,23.54 v26.03,26.04 | v17.78,26.67 D2.C
  Bottom 0.254: v17.78,26.67 25.4,26.67 v26.03,26.04
N$4
  Top 0.254: R4.2 35.27,26.67 U1.1
N$5
  Top 0.254: D2.A 11.95,27.84 R3.1
N$6
  Top 0.254: R1.2 35.57,23.77 U1.5
N$7
  Top 0.254: D1.A 11.43,25.4 10.8,26.04 10.8,29.21 12.06,30.48 R2.1
N$8  (via drill 0.6)
  Top 0.254: v29.84,26.04 29.84,27.94 29.62,28.16 U3.1
  Bottom 0.254: JP5.1 29.84,15.88 v29.84,26.04
N$9
  Top 0.254: U3.17 22.48,25.79 20.32,27.94 20.32,30.48 20.95,31.11 26.67,31.11 27.67,30.11 U3.4
N$10  (via drill 0.6)
  Top 0.254: U4.43 61.98,85.34 v62.23,85.09 | U6.7 99.4,31.46 v99.69,31.75
  Bottom 0.254: v62.23,85.09 84.46,85.09 92.07,77.47 92.07,48.26 92.71,47.62 92.71,38.73 v99.69,31.75
N$11  (via drill 0.6)
  Top 0.254: U4.41 62.99,86.87 v63.5,86.36 | U7.7 99.4,42.25 v99.69,42.55
  Bottom 0.254: v63.5,86.36 64.13,85.72 84.46,85.72 92.71,77.47 92.71,50.17 99.69,43.18 v99.69,42.55
N$12  (via drill 0.6)
  Top 0.254: U3.5 27.02,26.32 v27.3,26.04
  Bottom 0.254: JP4.1 26.67,17.14 27.94,18.41 27.94,20.32 27.3,20.96 v27.3,26.04
N$13
  Bottom 0.254: JP8.2 84.46,15.24 83.82,15.88 JP7.5
N$14  (via drill 0.6)
  Top 0.254: C3.1 52.71,26.67 53.66,25.71 U2.5 53.63,24.13 52.71,24.13 52.07,23.5 v52.07,20.96 | JP6.2 43.82,16.51 48.26,20.96 v48.9,20.96
  Bottom 0.254: v48.9,20.96 v52.07,20.96
N$15  (via drill 0.6)
  Top 0.254: JP7.1 88.9,19.05 87.63,20.32 v85.72,20.32 | v73.03,36.2 71.75,36.2 70.35,37.6 IC1.89
  Bottom 0.254: v85.72,20.32 85.09,19.68 82.55,19.68 81.91,20.32 81.91,32.39 80.01,34.29 79.38,33.66 78.74,34.29 74.93,34.29 v73.03,36.2
N$16  (via drill 0.6)
  Top 0.254: v48.26,47.62 R12.1
  Bottom 0.254: CN1.17 48.16,47.53 v48.26,47.62
N$17  (via drill 0.6)
  Top 0.254: v48.26,49.53 R13.1
  Bottom 0.254: CN1.18 47.26,48.53 v48.26,49.53
N$18  (via drill 0.6)
  Top 0.254: v48.26,51.44 R14.1
  Bottom 0.254: CN1.19 46.35,49.53 v48.26,51.44
N$19  (via drill 0.6)
  Top 0.254: R15.1 57.8,41.26 57.15,41.91 57.15,43.81 54.61,46.36 52.71,46.36 52.07,45.72 52.07,42.55 51.43,41.91 50.16,41.91 49.53,42.55 49.53,45.08 46.99,47.62 v46.99,52.07
  Bottom 0.254: v46.99,52.07 46.99,51.44 46.09,50.53 CN1.20
N$20
  Top 0.254: R14.2 R13.2 R12.2 | Q1.2 50.8,45.72 51.43,46.36 51.43,47.61 R12.2 | R15.2 58.42,43.18 54.61,46.99 52.71,46.99 52.07,47.62 R12.2
N$21
  Top 0.254: R16.1 54.29,42.56 Q1.1
N$22  (via drill 0.6)
  Top 0.254: IC1.94 66.5,35.1 v66.04,35.56 66.04,36.2 65.41,36.83 64.56,36.83 L1.1 | v69.85,33.02 71.7,31.17 IC1.4
  Bottom 0.254: v69.85,33.02 67.31,33.02 66.04,34.29 v66.04,35.56
N$23  (via drill 0.6)
  Top 0.254: IC1.90 67.04,37.1 v66.68,37.47 | JP8.1 91.44,12.7 90.81,13.34 90.81,19.68 v88.26,22.22
  Bottom 0.254: v66.68,37.47 66.68,38.1 67.31,38.73 71.75,38.73 75.56,34.92 78.74,34.92 79.38,34.29 80.01,34.92 82.55,32.39 82.55,24.13 83.19,23.5 87,23.5 v88.26,22.22
N$24  (via drill 0.6)
  Top 0.254: C6.1 96.52,16.51 | 96.52,16.51 95.25,17.78 JP8.3 | R5.1 98.44,17.16 97.79,16.51 96.52,16.51 | S1.2 104.78,54.25 104.78,50.17 103.5,48.89 103.5,45.08 107.95,40.64 107.95,31.75 103.5,27.31 v103.5,26.04
  Bottom 0.254: v103.5,26.04 103.5,23.5 101.6,21.59 94.62,21.59 93.34,20.32 JP8.3 | S1.2 S1.1
N$25  (via drill 0.6)
  Top 0.254: C18.1 84.46,21.59 83.19,20.32 Q2.2 | IC1.91 70.08,36.6 v71.12,35.56
  Bottom 0.254: Q2.2 76.2,20.32 74.29,22.22 74.29,32.39 v71.12,35.56
N$26  (via drill 0.6)
  Top 0.254: C19.1 69.43,17.57 70.48,16.51 71.12,16.51 73.66,19.05 Q2.1 | IC1.92 69.31,36.1 v69.85,35.56
  Bottom 0.254: v69.85,35.56 71.75,33.66 72.39,33.66 73.66,32.39 Q2.1
N$28
  Top 0.254: C4.1 96.1,27.52 96.78,28.21 U6.2 U6.3
N$29
  Top 0.254: R19.2 99.04,35.12 C21.1
N$30
  Top 0.254: C5.1 96.1,38.31 96.78,39 U7.2 U7.3
N$31
  Top 0.254: C21.2 100.54,34.71 100.97,34.29 100.97,31.75 100.02,30.81 U6.6
N$32
  Top 0.254: U7.6 100.02,41.6 100.97,42.55 100.97,45.08 98.43,47.62 98,47.62 C23.2
N$33
  Top 0.254: C23.1 95.67,49.95 95.88,50.17 R20.2
N$34
  Top 0.254: JP3.1 R21.2
N$35
  Top 0.254: JP3.2 R22.2
N$36
  Top 0.254: JP3.24 R44.2
N$59
  Top 0.254: JP3.3 R23.2
N$60
  Top 0.254: JP3.4 R24.2
N$61
  Top 0.254: JP3.5 R25.2
N$62
  Top 0.254: JP3.6 R26.2
N$63
  Top 0.254: JP3.7 R27.2
N$64
  Top 0.254: JP3.8 R28.2
N$65
  Top 0.254: JP3.9 R29.2
N$66
  Top 0.254: JP3.10 R30.2
N$67
  Top 0.254: JP3.11 R31.2
N$68
  Top 0.254: JP3.12 R32.2
N$69
  Top 0.254: JP3.13 R33.2
N$70
  Top 0.254: JP3.14 R34.2
N$71
  Top 0.254: JP3.15 R35.2
N$72
  Top 0.254: JP3.16 R36.2
N$73
  Top 0.254: JP3.17 R37.2
N$74
  Top 0.254: JP3.18 R38.2
N$75
  Top 0.254: JP3.19 R39.2
N$76
  Top 0.254: JP3.20 R40.2
N$77
  Top 0.254: JP3.21 R41.2
N$78
  Top 0.254: JP3.22 R42.2
N$79
  Top 0.254: JP3.23 R43.2
PA2  (via drill 0.6)
  Top 0.254: IC1.97 66.73,33.6 v64.77,35.56 | v55.88,37.47 51.43,33.02 44.45,33.02 41.27,36.2 | 41.27,36.2 40.64,36.83 40.64,41.91 v41.27,42.55 | v46.99,54.61 42.54,54.61 39.37,57.78 37.46,57.78 34.29,60.96 27.94,60.96 v25.4,58.42 | v31.75,35.56 v34.93,35.56 | v40.64,35.56 41.27,36.2
  Bottom 0.254: v64.77,35.56 62.87,33.66 58.42,33.66 55.88,36.2 v55.88,37.47 | v41.27,42.55 44.26,42.55 CN1.12 | CN1.23 45.91,53.53 v46.99,54.61 | v25.4,58.42 25.4,39.37 29.21,35.56 v31.75,35.56 | v40.64,35.56 v34.93,35.56
PA3  (via drill 0.6)
  Top 0.254: IC1.98 65.96,33.1 v64.77,34.29 | v54.61,37.47 54.61,36.83 51.43,33.66 44.45,33.66 41.27,36.83 41.27,41.28 42.54,42.55 42.54,43.81 v41.27,45.08
  Bottom 0.254: v54.61,37.47 54.61,36.83 58.42,33.02 63.5,33.02 v64.77,34.29 | CN1.15 41.72,45.53 v41.27,45.08 40.01,46.36 40.01,46.99 41.27,48.26 41.27,50.17 40.64,50.8 40.64,53.34 41.83,54.53 CN1.24
PA4  (via drill 0.6)
  Top 0.254: IC1.99 66.89,32.6 66.68,32.39 66.68,30.48 66.04,29.85 61.6,29.85 60.96,30.48 60.96,34.29 61.6,34.92 v62.23,34.92
  Bottom 0.254: v62.23,34.92 56.51,40.64 56.51,46.99 47.98,55.53 CN1.25 42.2,55.53 40.01,53.34 40.01,50.8 40.64,50.17 40.64,48.26 39.37,46.99 39.37,45.08 40.93,43.53 CN1.13
PA5  (via drill 0.6)
  Top 0.254: v62.23,36.2 60.96,36.2 60.32,35.56 60.32,29.85 60.96,29.21 66.68,29.21 67.94,30.48 67.94,31.85 IC1.100
  Bottom 0.254: CN1.26 47.61,56.53 57.15,46.99 57.15,41.28 v62.23,36.2
PA6  (via drill 0.6)
  Top 0.254: v62.23,37.47 60.32,37.47 59.69,36.83 59.69,29.21 60.32,28.57 69.85,28.57 70.2,28.93 IC1.1
  Bottom 0.254: CN1.27 47.24,57.53 57.79,46.99 57.79,41.91 v62.23,37.47
PA7  (via drill 0.6)
  Top 0.254: v62.23,38.73 59.69,38.73 59.05,38.1 59.05,29.21 60.32,27.94 69.85,27.94 70.7,28.79 IC1.2
  Bottom 0.254: CN1.28 46.88,58.53 58.42,46.99 58.42,42.55 v62.23,38.73
PB0  (via drill 0.6)
  Top 0.254: v62.23,40 59.69,40 58.42,38.73 58.42,29.21 60.32,27.31 71.12,27.31 72.2,28.39 IC1.5 | v53.34,48.26 56.51,51.44 56.51,52.7 v55.24,53.97
  Bottom 0.254: CN1.29 46.51,59.53 53.02,53.02 | 53.02,53.02 59.05,46.99 59.05,43.18 v62.23,40 | CN1.14 49.61,44.53 v53.34,48.26 | v55.24,53.97 53.98,53.97 53.02,53.02
PB1  (via drill 0.6)
  Top 0.254: v62.23,41.28 60.32,41.28 57.79,38.73 57.79,29.21 60.32,26.67 71.75,26.67 72.7,27.61 IC1.6
  Bottom 0.254: CN1.30 46.15,60.53 52.71,53.97 53.34,53.97 54.61,55.24 55.88,55.24 56.51,54.61 56.51,53.34 55.24,52.07 55.24,51.44 59.69,46.99 59.69,43.81 v62.23,41.28
PB2  (via drill 0.6)
  Top 0.254: v53.34,33.02 60.32,26.04 71.75,26.04 73.2,27.48 IC1.7
  Bottom 0.254: CN1.7 48.83,37.53 v53.34,33.02
PB3  (via drill 0.6)
  Top 0.254: v54.61,30.48 55.24,29.85 55.88,29.85 60.32,25.4 71.75,25.4 73.7,27.35 IC1.8
  Bottom 0.254: CN1.8 49.1,38.53 54.61,33.02 v54.61,30.48
PB4  (via drill 0.6)
  Top 0.254: v55.88,28.57 56.51,27.94 57.15,27.94 60.32,24.77 71.75,24.77 74.2,27.21 IC1.9
  Bottom 0.254: CN1.9 48.73,39.53 55.88,32.39 v55.88,28.57
PB5  (via drill 0.6)
  Top 0.254: v57.15,26.67 57.79,26.04 58.42,26.04 60.32,24.13 71.75,24.13 74.7,27.07 IC1.10
  Bottom 0.254: CN1.10 48.37,40.53 57.15,31.75 v57.15,26.67
PB6  (via drill 0.6)
  Top 0.254: v72.39,32.39 74.29,32.39 75.2,31.48 IC1.11 | v39.37,49.53 39.37,48.89 40.01,48.26 41.91,48.26 46.35,43.81 46.35,43.18 v46.99,42.55 | v62.87,31.11 v65.41,31.11
  Bottom 0.254: v72.39,32.39 71.12,31.11 v65.41,31.11 | CN1.31 41.85,61.53 40.01,59.69 40.01,53.97 39.37,53.34 v39.37,49.53 | v46.99,42.55 58.42,31.11 v62.87,31.11
PB7  (via drill 0.6)
  Top 0.254: IC1.12 75.7,31.61 73.66,33.66 71.75,33.66 v71.12,33.02 | R17.2 36.23,19.67 R18.1 42.56,19.67 44.45,17.78 47.62,20.96 47.62,29.21 v48.26,29.85
  Bottom 0.254: v48.26,29.85 48.9,29.85 53.34,25.4 59.05,25.4 64.13,30.48 64.13,31.75 64.77,32.39 68.58,32.39 69.22,31.75 69.85,31.75 v71.12,33.02
PC0  (via drill 0.6)
  Top 0.254: U5.CD 34.02,45.97 R10.1 34.27,43.2 v34.29,43.18 | v41.27,33.02 41.91,33.02 42.54,32.39 42.54,31.11 41.91,30.48 41.91,29.85 42.54,29.21 42.54,27.31 43.82,26.04 44.45,26.04 v45.09,26.67 | IC1.15 77.2,32.75 v77.47,33.02
  Bottom 0.254: v45.09,26.67 45.72,26.67 47.62,24.77 59.05,24.77 59.69,25.4 65.41,25.4 73.03,17.78 78.74,17.78 80.01,19.05 80.01,30.48 | 80.01,30.48 80.01,31.11 | v41.27,33.02 41.27,34.29 41.91,34.92 41.91,35.56 v34.29,43.18 | v77.47,33.02 80.01,30.48
PC1  (via drill 0.6)
  Top 0.254: v48.26,53.34 43.18,53.34 39.37,57.15 R11.1 36.21,56.5 36.2,56.48 v36.2,55.88 | v32.38,58.42 32.38,59.08 U5.WP | IC1.16 77.7,28.81 76.2,27.31 77.47,26.04 76.2,24.77 74.93,24.77 74.29,24.13 72.39,24.13 71.75,23.5 60.32,23.5 58.42,25.4 57.15,25.4 52.07,30.48 52.07,33.02 55.24,36.2 55.88,36.2 57.15,37.47 57.15,38.1 56.51,38.73 55.88,38.73 v55.24,39.37
  Bottom 0.254: v48.26,53.34 49.53,53.34 55.88,46.99 55.88,40 v55.24,39.37 | v36.2,55.88 35.56,55.24 34.29,55.24 32.38,57.15 v32.38,58.42
PD0
  Top 0.254: IC1.25 82.46,29.85 86.36,29.85 88.65,27.56 U6.20
PD1
  Top 0.254: IC1.26 86.01,32.1 86.36,31.75 86.36,30.48 88.63,28.21 U6.19
PD2
  Top 0.254: IC1.27 86.15,32.6 87,31.75 87,30.48 88.62,28.86 U6.18
PD3
  Top 0.254: IC1.28 86.28,33.1 87.63,31.75 87.63,30.48 88.6,29.5 U6.17
PD4
  Top 0.254: IC1.29 86.41,33.6 88.56,31.46 U6.14
PD5
  Top 0.254: IC1.30 86.55,34.1 88.54,32.11 U6.13
PD6
  Top 0.254: IC1.31 86.69,34.6 88.53,32.75 U6.12
PD7
  Top 0.254: IC1.32 86.82,35.1 88.51,33.41 U6.11
PE0
  Top 0.254: IC1.35 86.76,36.6 88.51,38.35 U7.20
PE1
  Top 0.254: IC1.36 86.63,37.1 88.53,39 U7.19
PE2
  Top 0.254: IC1.37 86.5,37.6 88.54,39.65 U7.18
PE3
  Top 0.254: IC1.38 86.36,38.1 88.26,40 | 88.28,39.99 88.26,40 | U7.17 88.56,40.3 88.26,40
PE4
  Top 0.254: IC1.39 86.22,38.6 89.88,42.25 U7.14
PE5
  Top 0.254: IC1.40 86.09,39.1 89.89,42.9 U7.13
PE6
  Top 0.254: IC1.41 85.96,39.6 89.91,43.55 U7.12
PE7
  Top 0.254: IC1.42 85.82,40.1 89.92,44.2 U7.11
PF0  (via drill 0.6)
  Top 0.254: v69.85,79.38 73.03,76.2 93.98,76.2 99.06,71.12 99.06,54.61 86.05,41.6 IC1.45 | v62.23,74.3 62.23,77.47 60.48,79.22 U4.15
  Bottom 0.254: v69.85,79.38 67.31,79.38 v62.23,74.3
PF1  (via drill 0.6)
  Top 0.254: v69.85,78.11 72.39,75.56 93.98,75.56 98.43,71.12 98.43,54.61 85.91,42.1 IC1.46 | v63.5,74.3 63.5,76.83 60.98,79.35 U4.16
  Bottom 0.254: v69.85,78.11 67.31,78.11 v63.5,74.3
PF2  (via drill 0.6)
  Top 0.254: v69.85,76.83 71.75,74.93 93.98,74.93 97.79,71.12 97.79,54.61 85.78,42.6 IC1.47 | v64.77,74.3 64.77,76.2 61.47,79.5 U4.17
  Bottom 0.254: v69.85,76.83 67.31,76.83 v64.77,74.3
PF3  (via drill 0.6)
  Top 0.254: v69.85,75.56 71.12,74.3 93.98,74.3 97.16,71.12 97.16,54.61 85.65,43.1 IC1.48 | v66.04,74.3 66.04,75.56 61.98,79.63 U4.18
  Bottom 0.254: v69.85,75.56 67.31,75.56 v66.04,74.3
PF4  (via drill 0.6)
  Top 0.254: v69.85,74.3 70.48,73.66 93.98,73.66 96.52,71.12 96.52,54.61 85.51,43.6 IC1.49 | v67.31,74.3 66.68,74.93 66.68,75.56 62.48,79.76 U4.19
  Bottom 0.254: v69.85,74.3 v67.31,74.3
PF5
  Top 0.254: U4.20 62.99,79.88 69.85,73.02 93.98,73.02 95.88,71.12 95.88,54.61 85.38,44.1 IC1.50
PF6  (via drill 0.6)
  Top 0.254: IC1.51 82.29,46.1 v83.82,47.62 | v88.9,77.47 87,79.38 72.39,79.38 70.48,81.28 69.85,81.28 67.31,78.74 65.41,78.74 63.98,80.16 U4.22
  Bottom 0.254: v83.82,47.62 83.82,48.26 88.26,52.7 88.26,64.77 88.83,65.33 arc45 88.9,65.51 88.9,72.39 88.26,73.02 88.26,76.2 88.9,76.83 v88.9,77.47
PF7  (via drill 0.6)
  Top 0.254: U4.21 63.48,80.03 65.41,78.11 67.31,78.11 69.85,80.64 70.48,80.64 72.39,78.74 86.36,78.74 v87.63,77.47 | IC1.52 81.7,47.41 81.91,47.62 v82.55,47.62
  Bottom 0.254: v82.55,47.62 87.63,52.7 87.63,64.66 arc-45 87.7,64.84 88.26,65.41 88.26,72.39 87.63,73.02 v87.63,77.47
PH0  (via drill 0.6)
  Top 0.254: IC1.55 80.2,49.08 80.65,49.53 v81.28,49.53 | v83.19,66.04 82.22,67 U$3.16
  Bottom 0.254: v81.28,49.53 83.82,52.07 83.82,65.41 v83.19,66.04
PH1  (via drill 0.6)
  Top 0.254: IC1.56 79.7,49.86 80.65,50.8 v81.28,50.8 | U$3.17 81.42,66.53 v81.91,66.04
  Bottom 0.254: v81.28,50.8 83.19,52.7 83.19,64.77 v81.91,66.04
PH2  (via drill 0.6)
  Top 0.254: IC1.57 79.2,50.62 80.65,52.07 v81.28,52.07 | v80.65,66.04 80.65,66.67 80.62,66.7 U$3.18
  Bottom 0.254: v81.28,52.07 81.91,52.07 82.55,52.7 82.55,64.13 v80.65,66.04
PH3
  Top 0.254: U$3.39 82.22,54.28 78.7,50.76 IC1.58
PH4  (via drill 0.6)
  Top 0.254: IC1.59 78.2,48.17 v77.47,48.89 | U$3.20 79.02,66.39 80.01,65.41 80.01,64.77 v78.1,62.86
  Bottom 0.254: v78.1,62.86 78.1,62.23 78.74,61.59 78.74,51.44 77.47,50.17 v77.47,48.89
PH5  (via drill 0.6)
  Top 0.254: U$3.21 78.22,65.92 v78.74,65.41 | IC1.60 77.7,44.86 78.34,44.86 v79.38,43.81
  Bottom 0.254: v78.74,65.41 79.38,64.77 79.38,56.52 81.28,54.61 81.28,53.34 80.01,52.07 80.01,50.8 79.38,50.17 v79.38,43.81
PH6  (via drill 0.6)
  Top 0.254: U$3.37 80.62,54.58 v80.01,53.97 | v78.1,43.81 77.2,44.72 IC1.61
  Bottom 0.254: v80.01,53.97 79.38,53.34 79.38,50.8 78.74,50.17 78.74,44.45 v78.1,43.81
PH7
  Top 0.254: U$3.38 81.42,54.11 76.2,48.89 76.84,48.26 76.84,47.62 76.7,47.49 IC1.62
PJ0  (via drill 0.6)
  Top 0.254: v90.81,66.04 90.81,66.67 90.95,66.82 arc45 91.02,66.99 U$3.5 | IC1.65 75.2,44.72 74.93,44.45 74.93,42.55 76.2,41.28 77.47,41.28 v78.74,42.55
  Bottom 0.254: v90.81,66.04 90.81,64.13 88.9,62.23 88.9,57.15 91.44,54.61 91.44,52.07 90.81,51.44 90.17,51.44 88.26,49.53 87.63,49.53 83.19,45.08 82.55,45.72 81.28,45.72 80.01,44.45 80.65,43.81 79.38,42.55 v78.74,42.55
PJ1  (via drill 0.6)
  Top 0.254: v75.56,71.75 76.2,72.39 85.09,72.39 87,70.48 87,69.22 86.22,68.44 U$3.11 | IC1.66 74.7,47.39 75.56,48.26 75.56,48.89 76.84,50.17 v76.84,50.8
  Bottom 0.254: v75.56,71.75 75.56,52.7 76.84,51.44 v76.84,50.8
PJ2
  Top 0.254: U$3.44 86.22,48.12 78.74,40.64 76.2,40.64 74.29,42.55 74.29,44.45 74.2,44.55 IC1.67
PJ3
  Top 0.254: U$3.50 91.02,52.28 88.48,52.28 87,50.8 87,48.26 78.74,40 76.2,40 73.66,42.55 73.66,44.45 73.7,44.49 IC1.68
PJ4
  Top 0.254: U$3.33 77.47,56.5 77.47,53.97 73.2,49.7 IC1.69
PJ5  (via drill 0.6)
  Top 0.254: U$3.34 78.22,54.09 73.66,49.53 74.29,48.89 v74.29,48.26 | IC1.70 72.7,44.76 v72.39,44.45
  Bottom 0.254: v74.29,48.26 74.29,45.08 73.66,44.45 73.66,43.81 73.03,43.81 v72.39,44.45
PJ6  (via drill 0.6)
  Top 0.254: U$3.22 77.42,64.08 76.84,63.5 76.84,61.59 72.39,57.15 v72.39,55.88 | IC1.71 72.2,47.44 72.39,47.62 v72.39,51.44
  Bottom 0.254: v72.39,51.44 v72.39,55.88
PJ7  (via drill 0.6)
  Top 0.254: U$3.35 79.02,54.25 74.93,50.17 v74.93,49.53 | IC1.72 71.7,47.68 71.12,48.26 v71.12,48.89
  Bottom 0.254: v71.12,48.89 71.75,49.53 v74.93,49.53
PK0  (via drill 0.6)
  Top 0.254: IC1.75 70.1,46.1 v67.94,48.26 | v61.6,48.89 62.23,48.89 69.85,56.52 69.85,69.85 72.39,72.39 73.66,72.39 76.62,69.43 U$3.23
  Bottom 0.254: v67.94,48.26 67.31,48.89 v61.6,48.89
PK1  (via drill 0.6)
  Top 0.254: IC1.76 68.2,46.1 v66.68,47.62 | v60.96,47.62 61.6,47.62 70.48,56.52 70.48,69.85 72.39,71.75 73.66,71.75 75.82,69.59 U$3.24
  Bottom 0.254: v66.68,47.62 v60.96,47.62
PK2  (via drill 0.6)
  Top 0.254: U$3.25 75.02,69.76 73.66,71.12 72.39,71.12 71.12,69.85 71.12,56.52 v60.96,46.36 | IC1.77 66.89,43.6 66.68,43.81 66.68,44.45 67.31,45.08 v66.04,46.36
  Bottom 0.254: v60.96,46.36 v66.04,46.36
PK3  (via drill 0.6)
  Top 0.254: v61.6,45.08 62.23,45.72 62.23,46.99 71.75,56.52 71.75,57.15 74.22,59.61 U$3.26 | v66.04,45.08 66.04,43.81 66.75,43.1 IC1.78
  Bottom 0.254: v61.6,45.08 v66.04,45.08
PK4  (via drill 0.6)
  Top 0.254: v62.23,43.81 62.87,44.45 62.87,46.99 70.48,54.61 73.66,54.61 74.22,55.17 U$3.29 | IC1.79 66.73,42.6 66.68,42.55 v66.68,41.91
  Bottom 0.254: v62.23,43.81 63.5,43.81 64.13,43.18 65.41,43.18 v66.68,41.91
PK5  (via drill 0.6)
  Top 0.254: v62.87,42.55 63.5,43.18 63.5,46.99 70.48,53.97 74.29,53.97 75.02,54.7 U$3.30 | IC1.80 70.04,42.1 v70.48,42.55
  Bottom 0.254: v62.87,42.55 62.87,41.91 64.13,40.64 65.41,40.64 66.04,40 67.31,40 67.94,40.64 70.48,40.64 71.12,40 72.39,40 73.03,40.64 73.03,41.91 71.75,43.18 71.12,43.18 v70.48,42.55
PK6  (via drill 0.6)
  Top 0.254: v64.13,41.91 64.13,46.99 70.48,53.34 74.93,53.34 75.82,54.23 U$3.31 | IC1.81 71.44,41.6 v71.75,41.91
  Bottom 0.254: v64.13,41.91 64.77,41.28 66.04,41.28 66.68,40.64 67.31,41.28 71.12,41.28 v71.75,41.91
PK7
  Top 0.254: IC1.82 67.13,41.1 66.68,40.64 64.77,42.55 64.77,46.99 70.48,52.7 75.56,52.7 76.62,53.76 U$3.32
PQ0  (via drill 0.6)
  Top 0.254: IC1.85 70.89,39.6 71.12,39.37 80.01,39.37 v80.65,40 | v95.88,34.29 96.77,33.41 U6.10
  Bottom 0.254: v80.65,40 81.28,39.37 86.36,39.37 87.63,38.1 87.63,34.92 88.9,33.66 95.25,33.66 v95.88,34.29
PQ1  (via drill 0.6)
  Top 0.254: IC1.86 70.75,39.1 71.12,38.73 v80.65,38.73 | v97.79,26.04 97.79,27.11 U6.1
  Bottom 0.254: v80.65,38.73 86.36,38.73 87,38.1 87,34.92 88.9,33.02 97.16,33.02 97.79,32.39 v97.79,26.04
PQ2  (via drill 0.6)
  Top 0.254: IC1.87 70.62,38.6 71.12,38.1 80.01,38.1 v80.65,37.47 | U7.10 99.44,44.2 v100.01,44.77
  Bottom 0.254: v80.65,37.47 81.28,37.47 81.91,38.1 85.72,38.1 86.36,37.47 86.36,34.92 97.16,24.13 99.06,24.13 99.69,23.5 100.33,23.5 101.6,24.77 101.6,26.67 102.87,27.94 106.04,27.94 111.76,33.66 111.76,38.1 105.09,44.77 v100.01,44.77
PQ3  (via drill 0.6)
  Top 0.254: IC1.88 70.48,38.1 71.12,37.47 79.38,37.47 v80.65,36.2 | v99.69,38.1 98.49,38.1 U7.1 | v99.06,22.86 99.69,23.5 99.69,24.13 v100.33,24.77
  Bottom 0.254: v80.65,36.2 81.91,37.47 85.09,37.47 85.72,36.83 85.72,34.92 97.79,22.86 v99.06,22.86 | v99.69,38.1 100.33,38.1 100.97,38.73 110.49,38.73 111.12,38.1 111.12,33.66 106.04,28.57 102.87,28.57 100.97,26.67 100.97,25.4 v100.33,24.77
RXD0  (via drill 0.6)
  Top 0.254: JP5.2 30.48,12.07 31.75,10.8 40.64,10.8 47.62,17.78 v47.62,18.41 | v77.47,21.59 76.84,20.96 76.84,15.88 v77.47,15.24 | IC1.17 78.2,28.67 77.47,27.94 v77.47,27.31
  Bottom 0.254: v77.47,15.24 76.2,13.97 75.56,13.97 74.29,15.24 73.03,15.24 70.48,17.78 49.53,17.78 48.9,17.14 48.26,17.14 47.62,17.78 v47.62,18.41 | v77.47,27.31 v77.47,21.59
SCK  (via drill 0.6)
  Top 0.254: v26.67,50.17 27.3,49.53 27.3,38.1 34.29,31.11 | v33.66,51.44 32.38,50.17 31.53,50.17 U5.5 | 34.29,31.11 36.2,31.11 43.82,23.5 43.82,22.22 44.45,21.59 v45.09,21.59 | IC1.22 80.7,28.63 80.65,28.57 80.65,26.67 77.47,23.5 74.93,23.5 74.29,22.86 73.03,22.86 72.39,22.22 60.96,22.22 60.32,21.59 v59.69,21.59 | R7.1 38.1,34.92 39.37,33.66 39.37,31.11 v38.73,30.48 | v36.2,29.85 35.56,29.85 34.29,31.11
  Bottom 0.254: v26.67,50.17 32.38,50.17 v33.66,51.44 | v45.09,21.59 45.72,22.22 58.42,22.22 59.05,21.59 v59.69,21.59 | v36.2,29.85 38.1,29.85 v38.73,30.48
SLICEBIN0  (via drill 0.6)
  Top 0.254: JP3.27 88.9,95.36 arc-45 88.83,95.18 86.36,92.71 86.36,86.36 87.63,85.09 90.17,85.09 90.81,84.45 90.81,80.64 100.33,71.12 100.33,46.99 106.68,40.64 106.68,32.39 94.62,20.32 92.81,20.32 arc-45 92.64,20.39 v89.53,23.5 | IC1.96 71.56,34.1 71.75,34.29 76.84,34.29 78.1,35.56 v78.1,36.2
  Bottom 0.254: v89.53,23.5 83.19,29.85 83.19,32.39 | 83.19,32.39 83.19,33.02 | 83.19,32.39 80.01,35.56 79.38,34.92 v78.1,36.2
SS  (via drill 0.6)
  Top 0.254: U5.1 33.45,40.22 R9.1 34.29,40.64 v34.93,41.28 | v41.27,31.75 41.27,27.94 43.82,25.4 v45.09,25.4 | IC1.19 79.2,32.56 v78.74,33.02
  Bottom 0.254: v34.93,41.28 35.56,40.64 35.56,38.1 33.66,36.2 33.66,34.92 36.83,31.75 v41.27,31.75 | v45.09,25.4 45.72,25.4 46.99,24.13 59.05,24.13 59.69,24.77 65.41,24.77 73.03,17.14 78.74,17.14 80.65,19.05 80.65,31.11 v78.74,33.02
TXD0  (via drill 0.6)
  Top 0.254: v48.9,18.41 40.64,10.16 29.21,10.16 JP4.2 | v76.2,15.24 76.2,21.59 78.1,23.5 v78.74,23.5 | v78.74,27.94 78.74,28.57 78.7,28.61 IC1.18
  Bottom 0.254: v48.9,18.41 70.48,18.41 73.03,15.88 75.56,15.88 v76.2,15.24 | v78.74,23.5 v78.74,27.94

## Text on the board
tPlace: A0 | A1 | A2 | A3 | A4 | A5 | A6 | A7 | A8 | A9 | A10 | A11 | A12 | A13 | A14 | A15 | A16 | A17 | A18 | A19 | A20 | A21 | A22 | A23 | BB6 | SB0 | 3V3 | GND | USB | BAT | 3V3 | PWR SWITCH
bPlace: RESET
tNames: BOARD INTERCONNECT | GND | MUX | SD CARD | SDRAM | ADC | FTDI | BTN | USB | PDI | GND | BAT JST | PDI | USB JMP | uC | RESET JMP
bNames: ASP LFC v1.0 Ctrl Rev A | TFT LCD